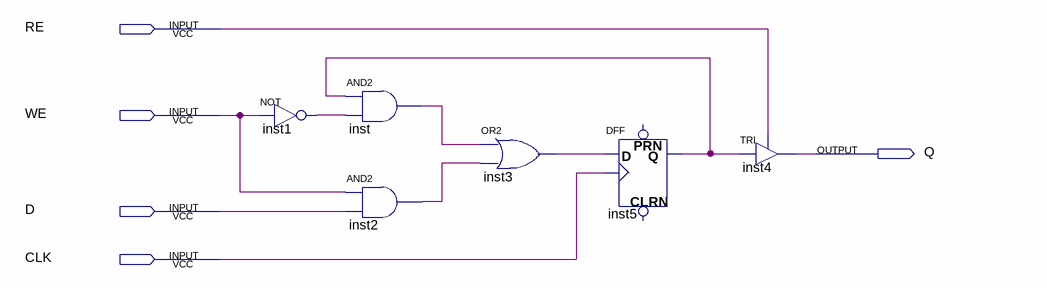
[diagram p0: schematic sheet]
// Quartus schematic Register_File_Cell.bdf as structural Verilog: 6 symbols, 5 pins
module Register_File_Cell (
  input  RE,
  input  WE,
  input  D,
  input  CLK,
  output Q
);

  wire inst1_out, inst2_out, inst3_out, inst5_q, inst_out;

  not inst1 (inst1_out, WE);
  and inst (inst_out, inst5_q, inst1_out);
  and inst2 (inst2_out, WE, D);
  or inst3 (inst3_out, inst_out, inst2_out);
  DFF inst5 (.CLK(CLK), .D(inst3_out), .Q(inst5_q));  // open: CLRN, PRN
  TRI inst4 (.IN(inst5_q), .OE(RE), .OUT(Q));
endmodule
